# Altium schematic sheet opto.SchDoc: High voltage quad opto isolation circuit
size A4; Date: 20xx-xx-xx; Author: Łukasz Przeniosło; CompanyName: Przenioslo Electronics & Software; Engineer: lukasz@przenioslo.com; Organization: PRZENIOSLO; Address1: Electronics; Address2: &; Address3: Software; DocumentNumber: 3; SheetNumber: 3; SheetTotal: 6
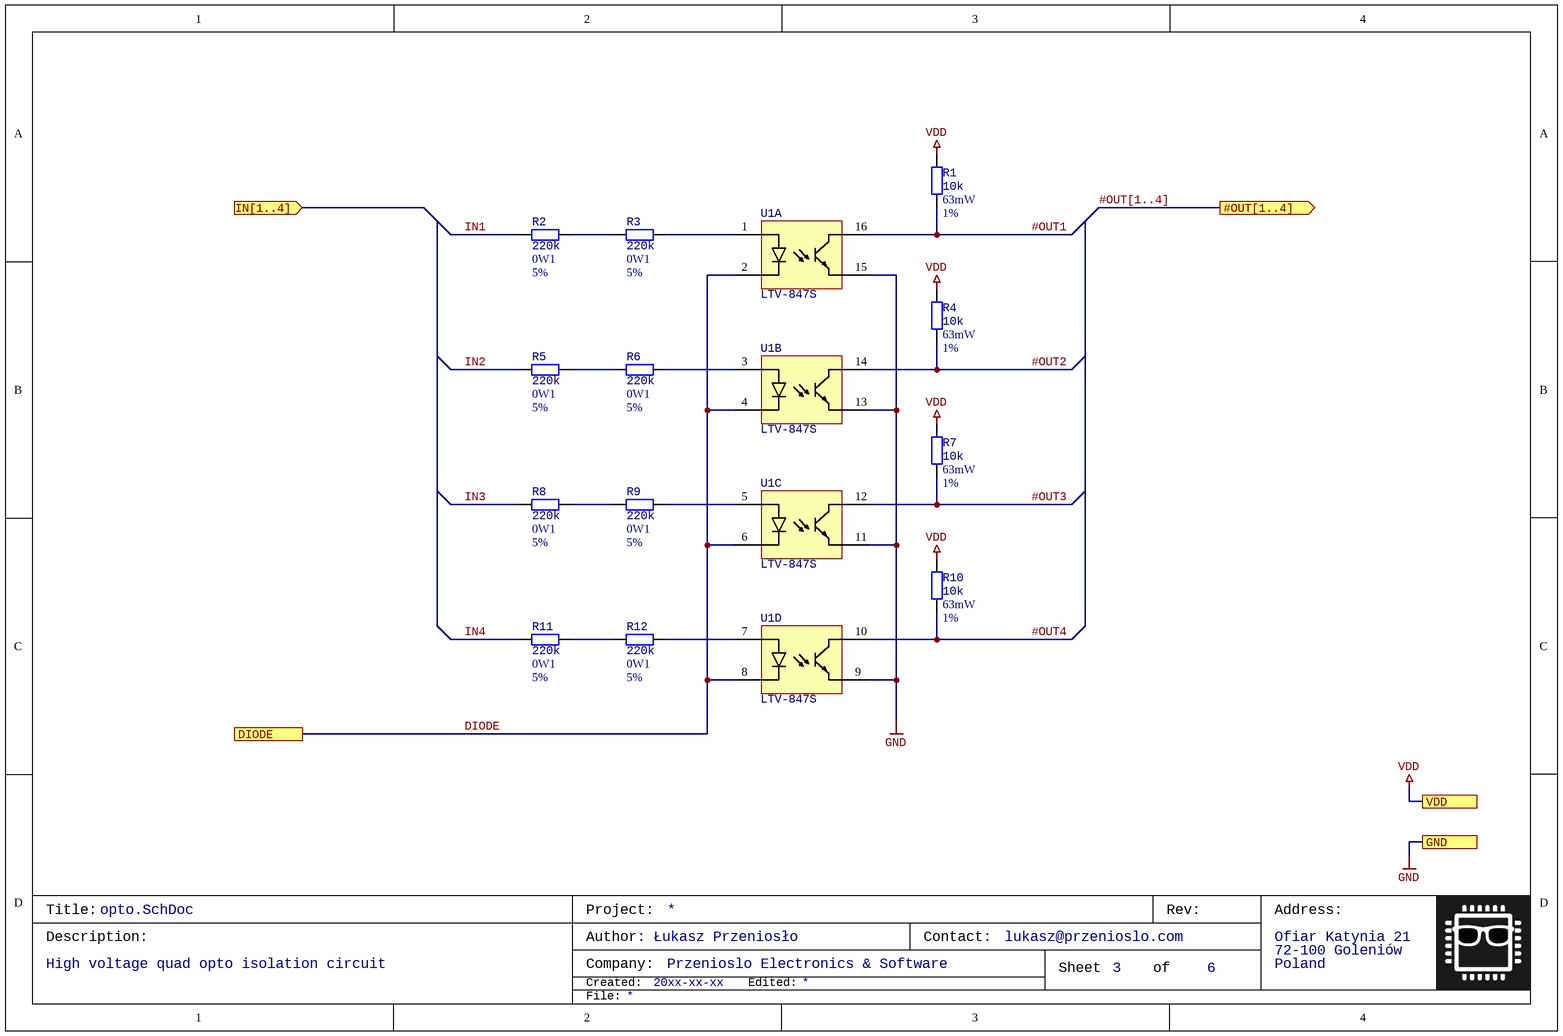
[diagram p0: opto.SchDoc]

## Parts
R1  10k  Power: 63mW  Tolerance: 1%  [RES0603]
R2  220k  Power: 0W1  Tolerance: 5%  [RES0603]
R3  220k  Power: 0W1  Tolerance: 5%  [RES0603]
R4  10k  Power: 63mW  Tolerance: 1%  [RES0603]
R5  220k  Power: 0W1  Tolerance: 5%  [RES0603]
R6  220k  Power: 0W1  Tolerance: 5%  [RES0603]
R7  10k  Power: 63mW  Tolerance: 1%  [RES0603]
R8  220k  Power: 0W1  Tolerance: 5%  [RES0603]
R9  220k  Power: 0W1  Tolerance: 5%  [RES0603]
R10  10k  Power: 63mW  Tolerance: 1%  [RES0603]
R11  220k  Power: 0W1  Tolerance: 5%  [RES0603]
R12  220k  Power: 0W1  Tolerance: 5%  [RES0603]
U1  LTV-847S  [GULLWING16]  (parts A,B,C,D of 4)

## Ports
#OUT[1..4] (out), DIODE, GND, IN[1..4] (in), VDD

## Nets
GND: U1.9(E4) U1.11(E3) U1.13(E2) U1.15(E1) ; port GND
VDD: R1.2 R4.2 R7.2 R10.2 ; port VDD
#OUT1: R1.1 U1.16(C1)
#OUT2: R4.1 U1.14(C2)
#OUT3: R7.1 U1.12(C3)
#OUT4: R10.1 U1.10(C4)
DIODE: U1.2(K1) U1.4(K2) U1.6(K3) U1.8(K4) ; port DIODE
IN1: R2.2
IN2: R5.2
IN3: R8.2
IN4: R11.2
NetR2_1: R2.1 R3.2
NetR3_1: R3.1 U1.1(A1)
NetR5_1: R5.1 R6.2
NetR6_1: R6.1 U1.3(A2)
NetR8_1: R8.1 R9.2
NetR9_1: R9.1 U1.5(A3)
NetR11_1: R11.1 R12.2
NetR12_1: R12.1 U1.7(A4)

## Buses and harness runs
bus #OUT[1..4] = port #OUT[1..4]

## Notes on the sheet
- Title:
- Project:
- Rev:
- Address:
- Description:
- Created:
- Author:
- Company:
- Edited:
- Contact:
- Sheet
- of
- Ofiar Katynia 21
- 72-100 Goleniów
- Poland
- File:

## Library data of the parts
R1-R12 = Resistor: Generic resistor symbol; Manufacturer: *; Identifier: *; Datasheet: *
  R1 R4 R7 R10: Value: 10k
  R2 R3 R5 R6 R8 R9 R11 R12: Value: 220k
U1 = Transoptor_16pin: Quad transoptor in 16 pin package; Manufacturer: Liteon; Identifier: LTV-847S